# EAGLE design DF12_32-to-header-pins (EAGLE 7.3.0)
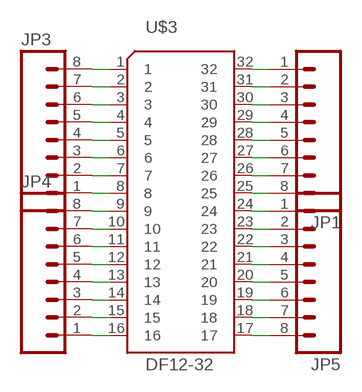
[diagram p0: schematic, sheet 1]

## Parts
JP1  M081X08  [1X08]
JP3  M081X08  [1X08]
JP4  M081X08  [1X08]
JP5  M081X08  [1X08]
U$3  DF12-32  [DF12-32]

## Nets
N$46: JP4.1 U$3.16
N$47: JP4.2 U$3.15
N$48: JP4.3 U$3.14
N$49: JP4.4 U$3.13
N$50: JP4.5 U$3.12
N$51: JP4.6 U$3.11
N$52: JP4.7 U$3.10
N$53: JP4.8 U$3.9
N$54: JP3.1 U$3.8
N$55: JP3.2 U$3.7
N$56: JP3.3 U$3.6
N$57: JP3.4 U$3.5
N$58: JP3.5 U$3.4
N$59: JP3.6 U$3.3
N$60: JP3.7 U$3.2
N$61: JP3.8 U$3.1
N$62: JP1.1 U$3.32
N$63: JP1.2 U$3.31
N$64: JP1.3 U$3.30
N$65: JP1.4 U$3.29
N$66: JP1.5 U$3.28
N$67: JP1.6 U$3.27
N$68: JP1.7 U$3.26
N$69: JP1.8 U$3.25
N$70: JP5.1 U$3.24
N$71: JP5.2 U$3.23
N$72: JP5.3 U$3.22
N$73: JP5.4 U$3.21
N$74: JP5.5 U$3.20
N$75: JP5.6 U$3.19
N$76: JP5.7 U$3.18
N$77: JP5.8 U$3.17

## Library data of the parts
JP1 JP3-JP5 = SparkFun-Connectors:M08: Header 8 Standard 8-pin 0.1" header. Use with straight break away headers (SKU : PRT-00116), right angle break away headers (PRT-00553), swiss pins (PRT-00743), machine pins (PRT-00117), and female headers (PRT-00115).
U$3 = awqua_eagle_library:DF12-32

## Board
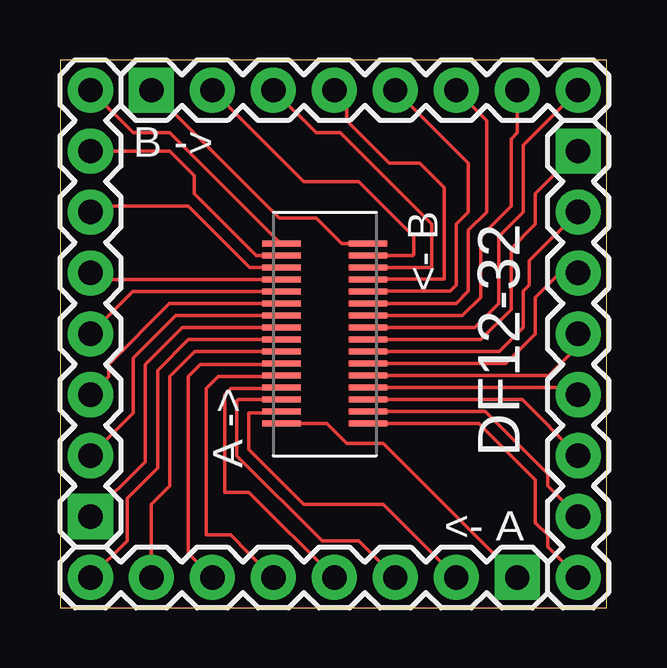
[diagram p1: board, top side]
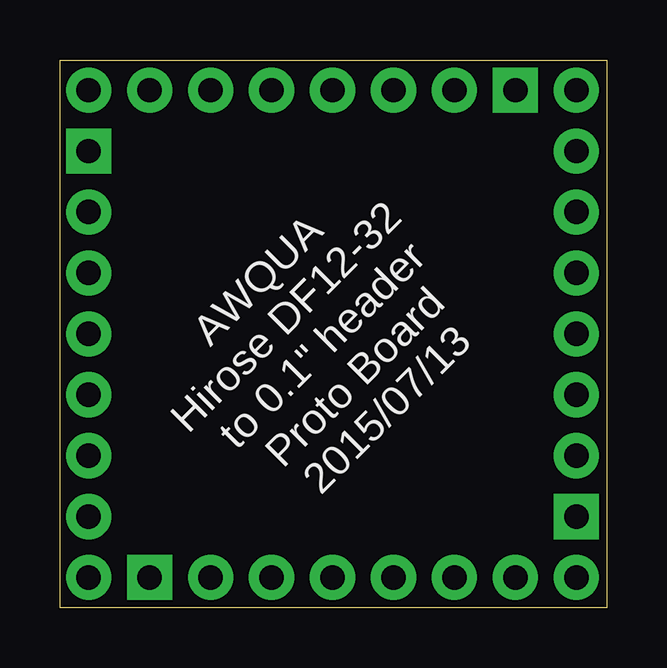
[diagram p2: board, bottom side, seen from below]

Size 22.78 x 22.85 mm. Coordinates in mm from the lower left corner, seen from the top.
Outline: 0,0 22.78,0 22.78,22.85 0,22.85 0,0
Copper layers (1*16): Top 0.035mm / dielectric 1.5mm / Bottom 0.035mm
Design rules "default": minimum track width 10mil, minimum drill 24mil, track to track 8mil, track to pad 8mil, pad to pad 8mil, via to via 8mil, smd to smd 8mil, copper to edge 40mil, drill to drill 8mil, minimum pad ring 10mil, minimum via ring 8mil, stop-mask expansion 4mil, vias tented up to drill 0mil, thermal gap 10mil

### Footprints (pad centres in the part's own frame; a part is rotated, then mirrored left to right if it is on the bottom)
1X08 = drill 1.016 pad 1.88 square: 1 0,0 | drill 1.016 pad 1.88: 2 2.54,0; 3 5.08,0; 4 7.62,0; 5 10.16,0; 6 12.7,0; 7 15.24,0; 8 17.78,0
DF12-32 = smd 1.6 x 0.25: 1 0.34,8.84; 2 0.34,8.34; 3 0.34,7.84; 4 0.34,7.34; 5 0.34,6.84; 6 0.34,6.34; 7 0.34,5.84; 8 0.34,5.34; 9 0.34,4.84; 10 0.34,4.34; 11 0.34,3.84; 12 0.34,3.34; 13 0.34,2.84; 14 0.34,2.34; 15 0.34,1.84; 16 0.34,1.34; 17 3.94,1.34; 18 3.94,1.84; 19 3.94,2.34; 20 3.94,2.84; 21 3.94,3.34; 22 3.94,3.84; 23 3.94,4.34; 24 3.94,4.84; 25 3.94,5.34; 26 3.94,5.84; 27 3.94,6.34; 28 3.94,6.84; 29 3.94,7.34; 30 3.94,7.84; 31 3.94,8.34; 32 3.94,8.84

### Placement (x,y rotation side)
JP1  3.81,21.59 0 top
JP3  1.27,3.81 90 top
JP4  19.05,1.27 180 top
JP5  21.59,19.05 270 top
U$3  8.89,6.35 0 top

### Tracks (layer width: path | path; a pad name or v marks a point on that pad's centre or on a via)
N$46
  Top 0.152: U$3.16 11.11,7.69 11.94,6.86 13.46,6.86 JP4.1
N$47
  Top 0.152: JP4.2 13.46,4.32 10.16,4.32 7.87,6.6 7.87,8.13 9.17,8.13 U$3.15
N$48
  Top 0.152: U$3.14 7.42,8.69 7.37,8.64 7.37,6.35 10.92,2.79 12.45,2.79 JP4.3
N$49
  Top 0.152: JP4.4 7.87,4.83 6.86,4.83 6.86,8.89 7.11,9.14 9.18,9.14 U$3.13
N$50
  Top 0.152: JP4.5 7.87,2.29 7.11,3.05 6.1,3.05 6.1,9.14 6.6,9.65 9.19,9.65 U$3.12
N$51
  Top 0.152: JP4.6 5.33,2.29 5.33,9.65 5.84,10.16 9.2,10.16 U$3.11
N$52
  Top 0.152: U$3.10 5.61,10.69 4.57,9.65 4.57,5.08 3.81,4.32 JP4.7
N$53
  Top 0.152: U$3.9 5.35,11.19 4.06,9.91 4.06,5.84 2.79,4.57 2.79,2.79 JP4.8
N$54
  Top 0.152: U$3.8 5.09,11.69 3.56,10.16 3.56,6.1 JP3.1
N$55
  Top 0.152: U$3.7 4.82,12.19 3.05,10.41 3.05,8.13 JP3.2
N$56
  Top 0.152: U$3.6 4.56,12.69 2.03,10.16 2.03,9.65 JP3.3
N$57
  Top 0.152: U$3.5 3.03,13.19 JP3.4
N$58
  Top 0.152: U$3.4 1.55,13.69 JP3.5
N$59
  Top 0.152: U$3.3 7.91,14.19 5.33,16.76 1.52,16.76 JP3.6
N$60
  Top 0.152: U$3.2 8.17,14.69 5.59,17.27 5.59,18.03 4.57,19.05 JP3.7
N$61
  Top 0.152: U$3.1 9.19,15.19 4.57,19.81 3.05,19.81 JP3.8
N$62
  Top 0.152: U$3.32 11.73,15.19 10.67,16.26 9.14,16.26 JP1.1
N$63
  Top 0.152: U$3.31 14.69,14.69 14.73,14.73 14.73,15.49 12.45,17.78 10.16,17.78 JP1.2
N$64
  Top 0.152: U$3.30 15.46,14.19 15.49,14.22 15.49,16 11.68,19.81 10.67,19.81 JP1.3
N$65
  Top 0.152: JP1.4 11.94,21.59 11.94,20.32 13.72,18.54 14.99,18.54 16,17.53 16,13.72 12.86,13.72 U$3.29
N$66
  Top 0.152: JP1.5 17.02,18.54 17.02,16.51 16.51,16 16.51,13.46 16.26,13.21 12.85,13.21 U$3.28
N$67
  Top 0.152: JP1.6 17.78,20.32 17.78,16.51 17.02,15.75 17.02,13.21 16.51,12.7 U$3.27
N$68
  Top 0.152: U$3.26 16.76,12.19 17.53,12.95 17.53,15.49 18.8,16.76 18.8,19.56 19.05,19.81 JP1.7
N$69
  Top 0.152: U$3.25 17.28,11.69 18.29,12.7 18.29,15.49 19.3,16.51 19.3,19.3 JP1.8
N$70
  Top 0.152: U$3.24 17.54,11.19 18.8,12.45 18.8,14.99 19.81,16 19.81,17.27 JP5.1
N$71
  Top 0.152: U$3.23 18.31,10.69 19.3,11.68 19.3,13.21 19.56,13.46 19.56,14.48 JP5.2
N$72
  Top 0.152: U$3.22 18.57,10.19 19.81,11.43 19.81,12.95 20.83,13.97 JP5.3
N$73
  Top 0.152: U$3.21 20.28,9.69 20.32,9.65 21.34,10.67 21.34,11.18 JP5.4
N$74
  Top 0.152: U$3.20 21.29,9.19 JP5.5
N$75
  Top 0.152: U$3.19 19.25,8.69 JP5.6
N$76
  Top 0.152: U$3.18 17.72,8.19 20.32,5.59 20.32,5.08 JP5.7
N$77
  Top 0.152: U$3.17 17.46,7.69 19.81,5.33 19.81,3.56 20.32,3.05 20.32,2.54 JP5.8

### Text on the board
tPlace: B -> | <- B | A -> | <- A
bPlace: AWQUA / Hirose DF12-32 / to 0.1" header / Proto Board / 2015/07/13